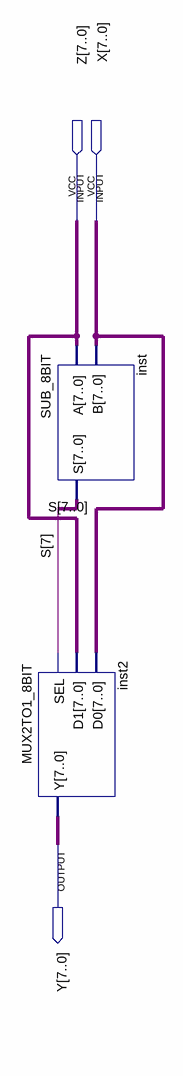
[diagram p0: schematic sheet]
// Quartus schematic MIN_8BIT.bdf as structural Verilog: 2 symbols, 3 pins
module MIN_8BIT (
  input  [7:0] Z,
  input  [7:0] X,
  output [7:0] Y
);

  wire [7:0] S;

  SUB_8BIT inst (.A(Z), .B(X), .S(S));
  MUX2TO1_8BIT inst2 (.SEL(S[7]), .D1(Z), .D0(X), .Y(Y));
endmodule
